# EAGLE design wiegand (EAGLE 6.6.0)
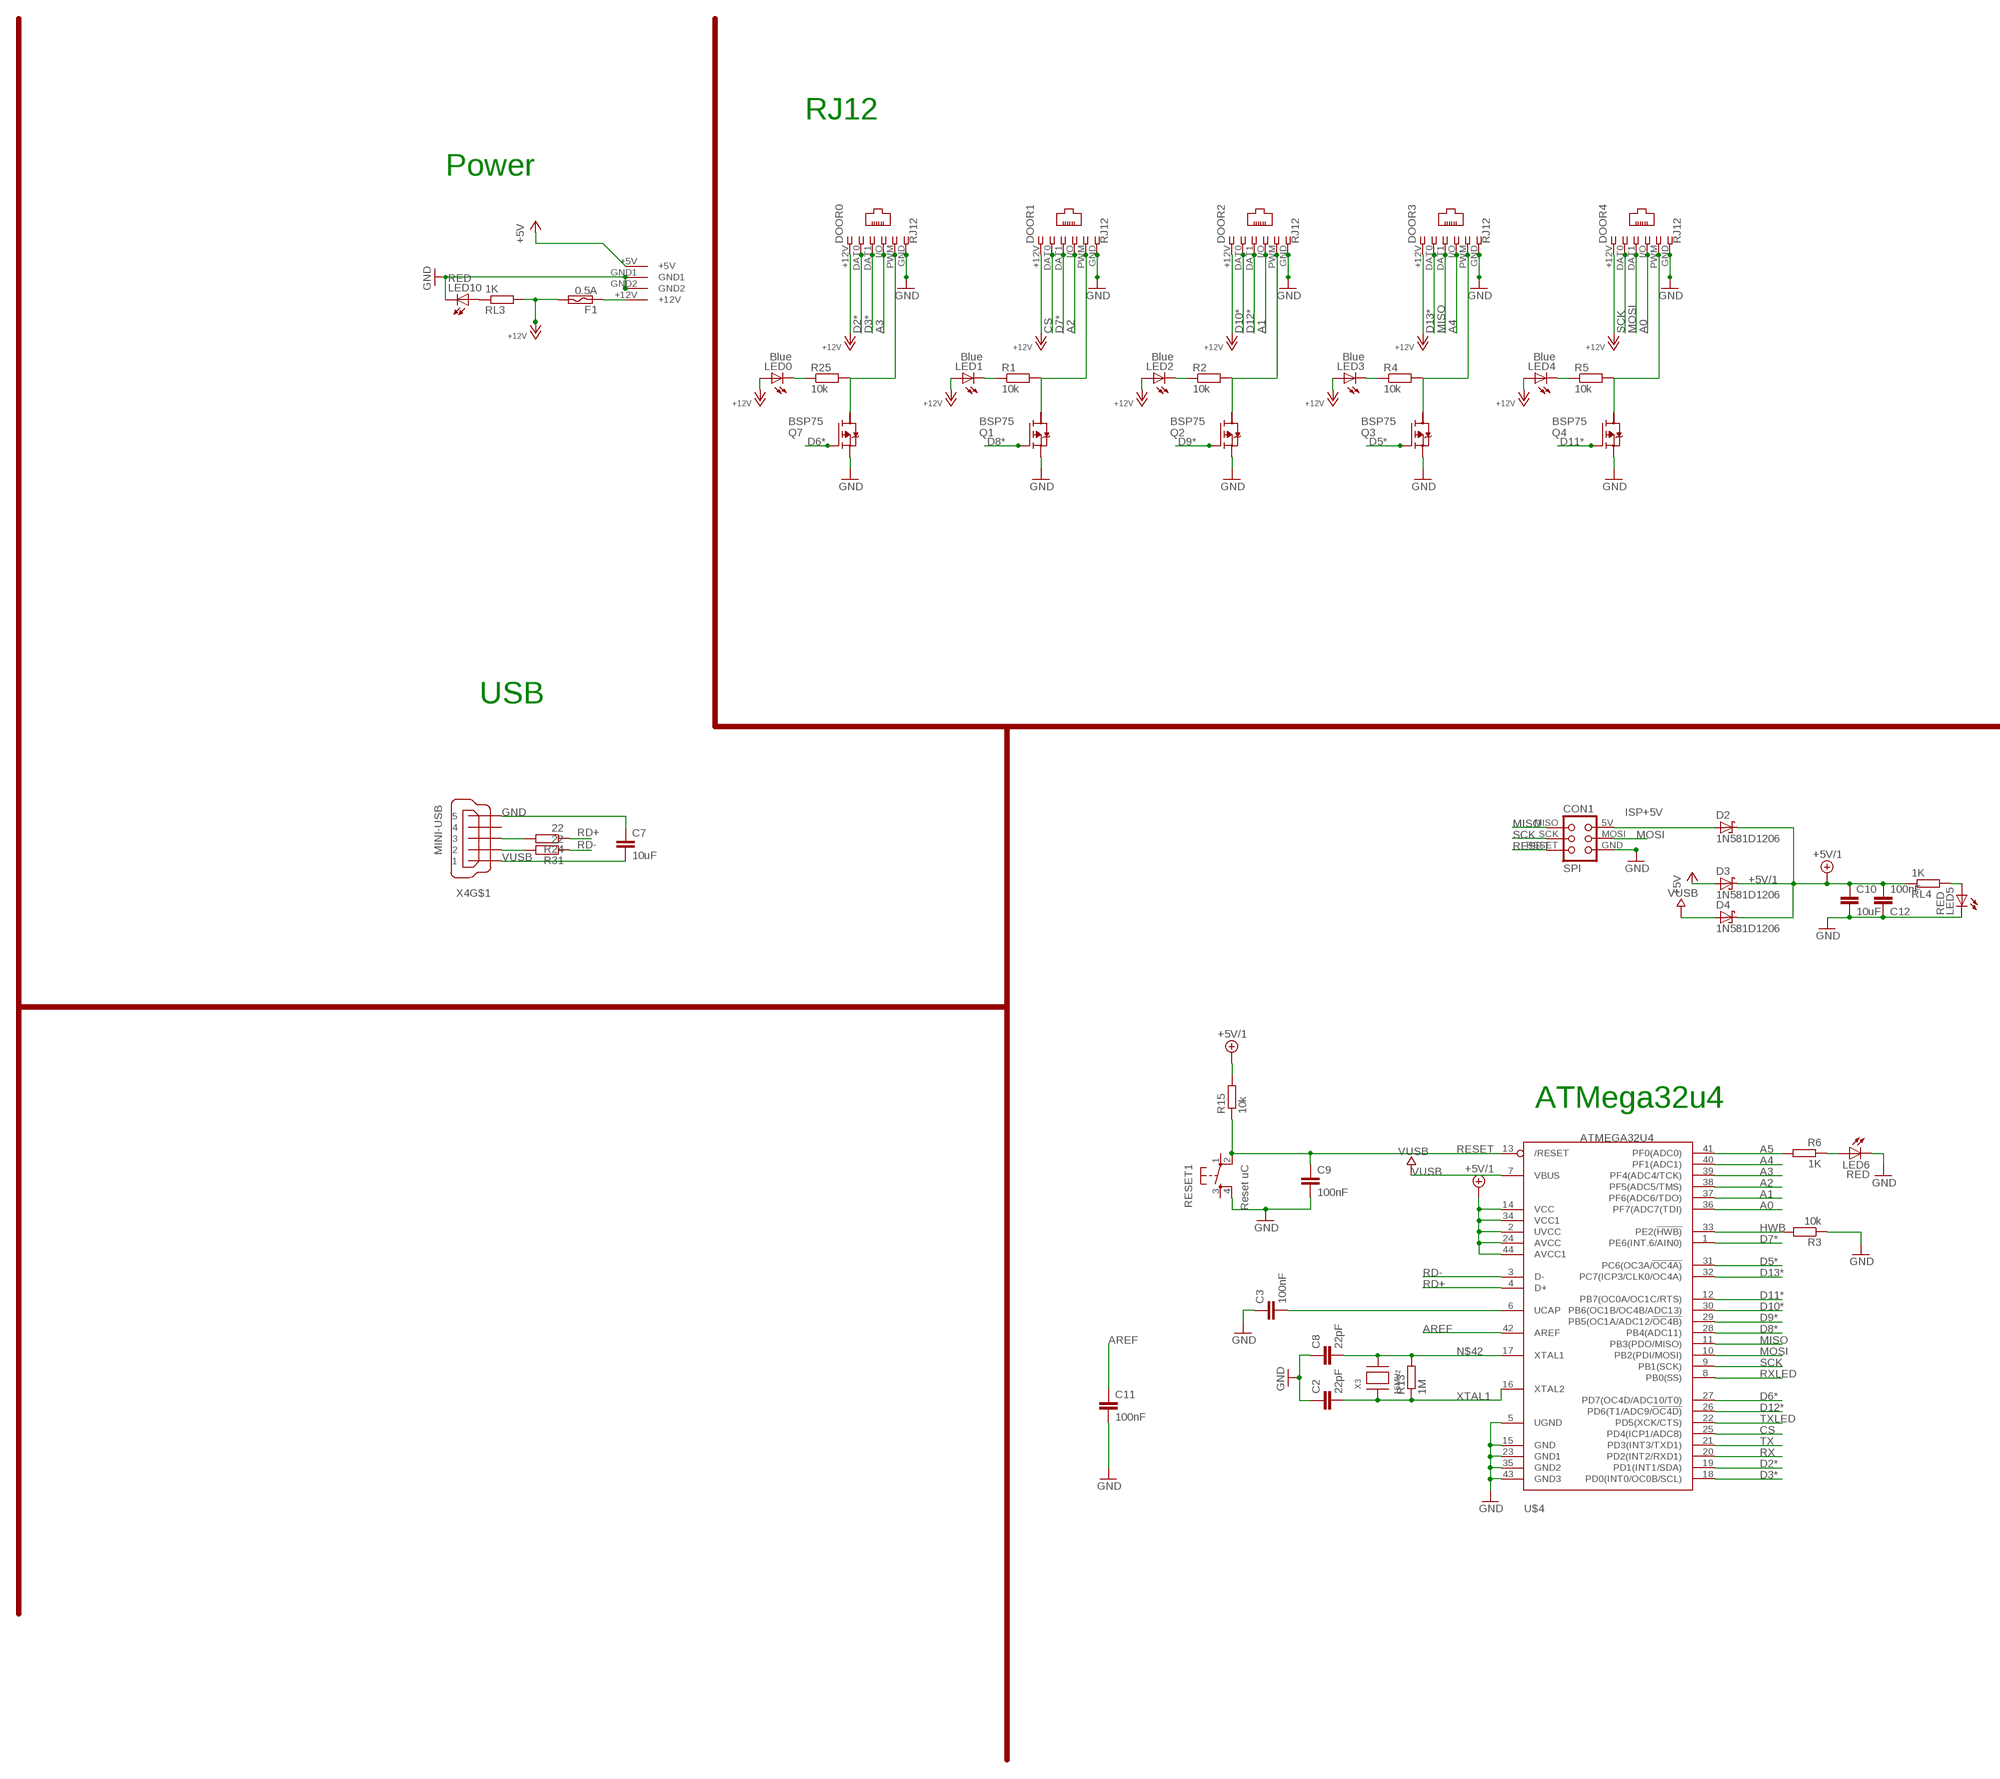
[diagram p0: schematic, sheet 1, part 1 of 2]
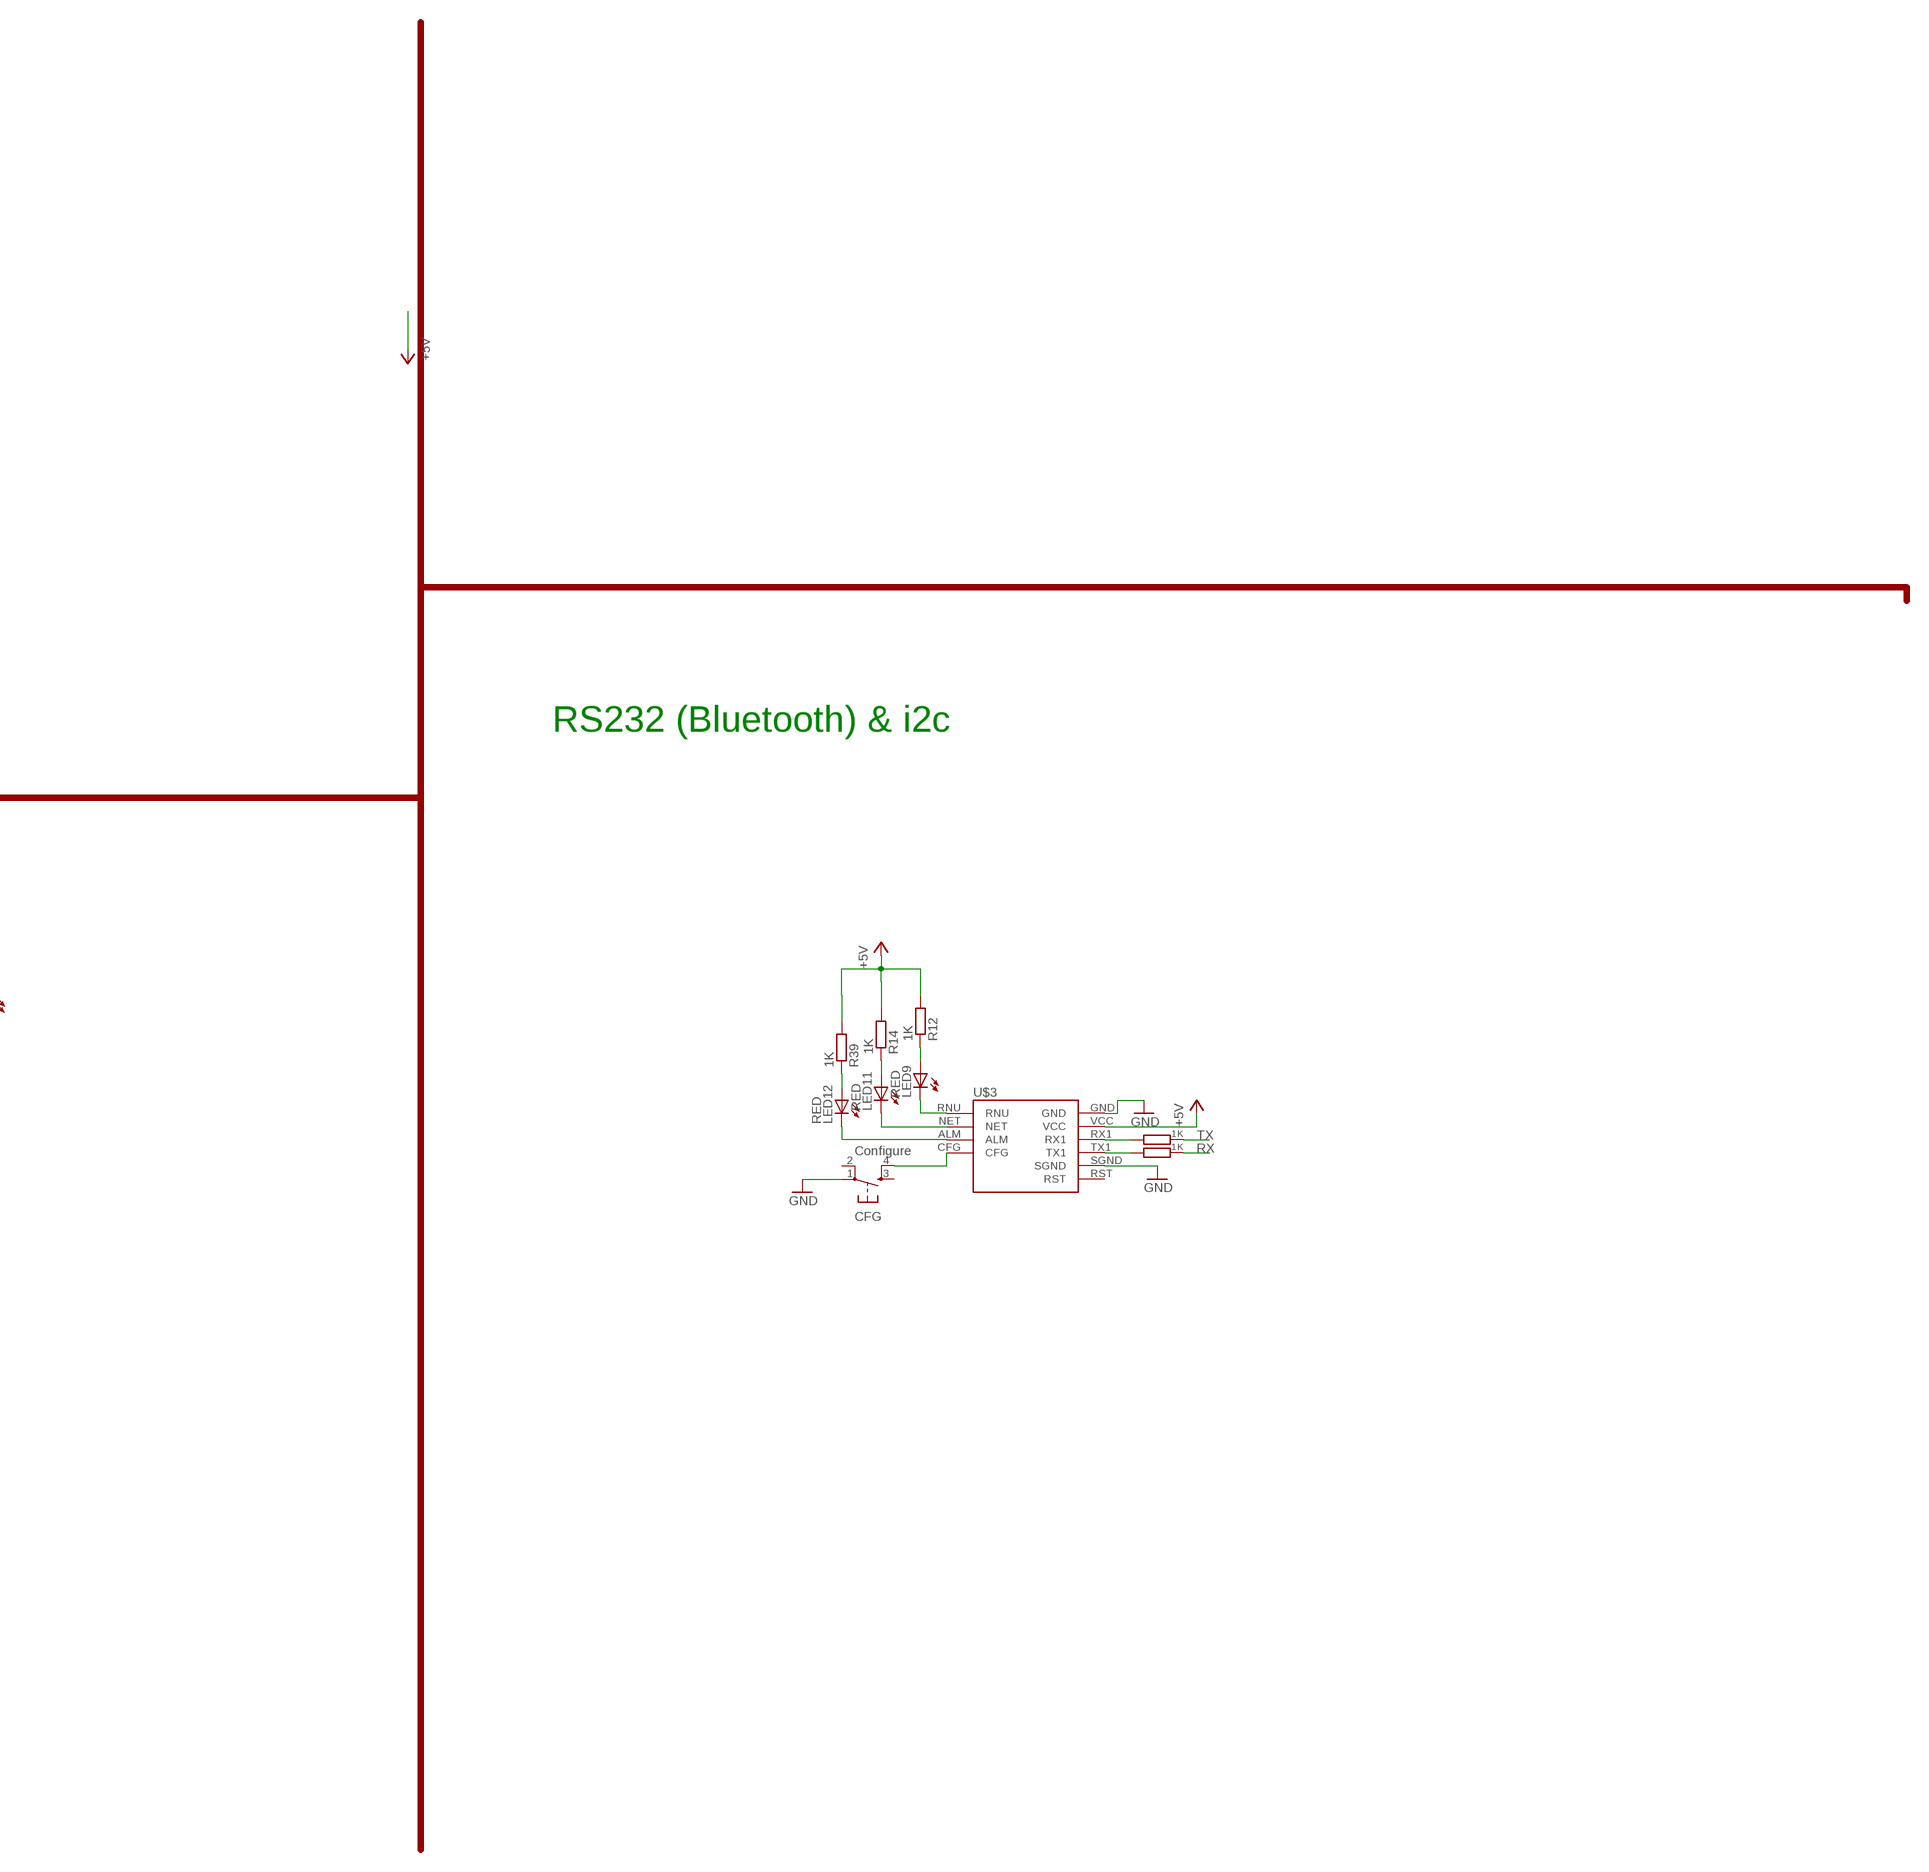
[diagram p1: schematic, sheet 1, part 2 of 2]

## Parts
C2  22pF  C-EUC1206  [C1206]
C3  100nF  C-EUC1206  [C1206]
C7  10uF  C-EUC1206  [C1206]
C8  22pF  C-EUC1206  [C1206]
C9  100nF  C-EUC1206  [C1206]
C10  10uF  C-EUC1206  [C1206]
C11  100nF  C-EUC1206  [C1206]
C12  100nF  C-EUC1206  [C1206]
CFG  Configure  TAC_SWITCHSMD  [TACTILE_SWITCH_SMD]
CON1  SPI  TINYISPTAG  [TC2030-MCP]
D2  1N581D1206  [LED-1206]
D3  1N581D1206  [LED-1206]
D4  1N581D1206  [LED-1206]
DOOR0  RJ12  RJ12STR-WIEGAND  [RJ12-STRAIGHT-WIEGAND]
DOOR1  RJ12  RJ12STR-WIEGAND  [RJ12-STRAIGHT-WIEGAND]
DOOR2  RJ12  RJ12STR-WIEGAND  [RJ12-STRAIGHT-WIEGAND]
DOOR3  RJ12  RJ12STR-WIEGAND  [RJ12-STRAIGHT-WIEGAND]
DOOR4  RJ12  RJ12STR-WIEGAND  [RJ12-STRAIGHT-WIEGAND]
F1  0.5A  POLYSWITCHSMD1812  [C1812]
LED0  Blue  LED1206  [LED-1206]
LED1  Blue  LED1206  [LED-1206]
LED2  Blue  LED1206  [LED-1206]
LED3  Blue  LED1206  [LED-1206]
LED4  Blue  LED1206  [LED-1206]
LED5  RED  LED1206  [LED-1206]
LED6  RED  LED1206  [LED-1206]
LED9  RED  LED1206  [LED-1206]
LED10  RED  LED1206  [LED-1206]
LED11  RED  LED1206  [LED-1206]
LED12  RED  LED1206  [LED-1206]
Q1  BSP75  BSP613P  [PG-SOT-223]
Q2  BSP75  BSP613P  [PG-SOT-223]
Q3  BSP75  BSP613P  [PG-SOT-223]
Q4  BSP75  BSP613P  [PG-SOT-223]
Q7  BSP75  BSP613P  [PG-SOT-223]
R1  10k  R-EU_R0805  [R0805]
R2  10k  R-EU_R0805  [R0805]
R3  10k  R-EU_M0805  [M0805]
R4  10k  R-EU_R0805  [R0805]
R5  10k  R-EU_R0805  [R0805]
R6  1K  R-EU_R0805  [R0805]
R8  1K  R-EU_R0805  [R0805]
R11  1K  R-EU_R0805  [R0805]
R12  1K  R-EU_R0805  [R0805]
R13  1M  R-EU_R1206  [R1206]
R14  1K  R-EU_R0805  [R0805]
R15  10k  R-EU_M0805  [M0805]
R24  22  R-EU_M1206  [M1206]
R25  10k  R-EU_R0805  [R0805]
R31  22  R-EU_M1206  [M1206]
R39  1K  R-EU_R0805  [R0805]
RESET1  Reset uC  TAC_SWITCHSMD  [TACTILE_SWITCH_SMD]
RL3  1K  R-EU_R0805  [R0805]
RL4  1K  R-EU_R0805  [R0805]
U$3  SZ05-ZIGBEE  [SZ05-ZIGBEE]
U$4  ATMEGA32U4  ATMEGA32U4-AU  [TQFP44]
U$6  KPJX-4S-S  [KPJX-4S-S]
X3  16MHz  XTALNX6035  [NX6035]
X4  MINI-USB  MINI-USB-SCHIELD-32005-201  [32005-201]

## Nets
+5V [power]: D3.A R12.2 R14.2 R39.2 U$3.VCC U$6.+5V
+5V1 [power]: R6.2
+5V/1 [fine]: C10.1 C12.2 D2.C D3.C D4.C R15.2 RL4.1 U$4.2(UVCC) U$4.14(VCC) U$4.24(AVCC) U$4.34(VCC1) U$4.44(AVCC1)
+12V [power]: DOOR0.+12V DOOR1.+12V DOOR2.+12V DOOR3.+12V DOOR4.+12V F1.2 LED0.A LED1.A LED2.A LED3.A LED4.A RL3.2
A0: DOOR4.I/O U$4.36(PF7(ADC7(TDI))
A1: DOOR2.I/O U$4.37(PF6(ADC6/TDO))
A2: DOOR1.I/O U$4.38(PF5(ADC5/TMS))
A3: DOOR0.I/O U$4.39(PF4(ADC4/TCK))
A4: DOOR3.I/O U$4.40(PF1(ADC1))
A5: U$4.41(PF0(ADC0))
AREF: C11.1 U$4.42(AREF)
CS: DOOR1.DAT0 U$4.25(PD4(ICP1/ADC8))
D2*: DOOR0.DAT0 U$4.19(PD1(INT1/SDA))
D3*: DOOR0.DAT1 U$4.18(PD0(INT0/OC0B/SCL))
D5*: Q3.1(G) U$4.31(PC6(OC3A/!OC4A))
D6*: Q7.1(G) U$4.27(PD7(OC4D/ADC10/T0))
D7*: DOOR1.DAT1 U$4.1(PE6(INT.6/AIN0))
D8*: Q1.1(G) U$4.28(PB4(ADC11))
D9*: Q2.1(G) U$4.29(PB5(OC1A/ADC12/!OC4B))
D10*: DOOR2.DAT0 U$4.30(PB6(OC1B/OC4B/ADC13))
D11*: Q4.1(G) U$4.12(PB7(OC0A/OC1C/RTS))
D12*: DOOR2.DAT1 U$4.26(PD6(T1/ADC9/!OC4D))
D13*: DOOR3.DAT0 U$4.32(PC7(ICP3/CLK0/OC4A))
D+USB: R24.2 X4.3
D-USB: R31.2 X4.2
GND [power]: C2.1 C3.1 C7.1 C8.1 C9.2 C10.2 C11.2 C12.1 CFG.1 CON1.GND DOOR0.GND DOOR1.GND DOOR2.GND DOOR3.GND DOOR4.GND LED5.C LED6.C LED10.C Q1.3(S) Q2.3(S) Q3.3(S) Q4.3(S) Q7.3(S) R3.1 RESET1.4 U$3.GND U$3.SGND U$4.5(UGND) U$4.15(GND) U$4.23(GND1) U$4.35(GND2) U$4.43(GND3) U$6.GND1 U$6.GND2 X4.5
GND1 [VIN]: LED9.C U$3.RNU
GND2 [VIN]: LED11.C U$3.NET
GND3 [VIN]: LED12.C U$3.ALM
HWB: R3.2 U$4.33(PE2(!HWB))
ISP+5V: CON1.5V(VCC) D2.A
MISO: CON1.MISO DOOR3.DAT1 U$4.11(PB3(PDO/MISO))
MOSI: CON1.MOSI DOOR4.DAT1 U$4.10(PB2(PDI/MOSI))
N$1: LED0.C R25.1
N$2: LED6.A R6.1
N$3 [power]: DOOR1.PWM Q1.2(D) R1.2
N$5: LED1.C R1.1
N$6: LED2.C R2.1
N$7 [power]: DOOR2.PWM Q2.2(D) R2.2
N$8: LED3.C R4.1
N$9: LED4.C R5.1
N$11: R11.2 U$3.RX1
N$12: LED5.A RL4.2
N$16: C3.2 U$4.6(UCAP)
N$22 [power]: DOOR3.PWM Q3.2(D) R4.2
N$23 [power]: DOOR0.PWM Q7.2(D) R25.2
N$24: R8.2 U$3.TX1
N$25: LED9.A R12.1
N$26: LED11.A R14.1
N$27: LED12.A R39.1
N$31 [power]: DOOR4.PWM Q4.2(D) R5.2
N$35: CFG.4 U$3.CFG
N$39: F1.1 U$6.+12V
N$42: C8.2 R13.2 U$4.17(XTAL1) X3.P$2
N$75: LED10.A RL3.1
RD+: R24.1 U$4.4(D+)
RD-: R31.1 U$4.3(D-)
RESET: C9.1 CON1.RESET R15.1 RESET1.2 U$4.13(/RESET)
RX: R8.1 U$4.20(PD2(INT2/RXD1))
RXLED: U$4.8(PB0(SS))
SCK: CON1.SCK DOOR4.DAT0 U$4.9(PB1(SCK))
TX: R11.1 U$4.21(PD3(INT3/TXD1))
TXLED: U$4.22(PD5(XCK/CTS))
VUSB: C7.2 D4.A U$4.7(VBUS) X4.1
XTAL1: C2.2 R13.1 U$4.16(XTAL2) X3.P$1
Unconnected: CFG.2 CFG.3 Q1.4(D) Q2.4(D) Q3.4(D) Q4.4(D) Q7.4(D) RESET1.1 RESET1.3 U$3.RST X4.4 X4.M1(S:S1) X4.M2(S:S2) X4.M3(S:S3) X4.M4(S:S4)

## Notes on the sheet
- RJ12
- Power
- RS232 (Bluetooth) & i2c
- USB
- ATMega32u4

## Library data of the parts
C2 C3 C7-C12 = rcl:C-EU: CAPACITOR, European symbol
CFG RESET1 = lpatiny:TAC_SWITCH: Momentary Switch Button commonly used for reset or general input. Spark Fun Electronics SKU : COM-00097
CON1 = lpatiny:TINYISP: CONNECTOR
D2-D4 = lpatiny:1N581*: 1.0A SCHOTTKY BARRIER RECTIFIER Source: http://www.diodes.com/datasheets/ds23001.pdf
DOOR0 DOOR1-DOOR4 = lpatiny:RJ12: CORCOM Modular RJ Jacks No Shield Source: www.tycoelectronics.com .. ENG_DS_1654001_1099_RJ_L_0507.pdf
F1 = lpatiny:POLYSWITCH: PolySwitch (TM) Resettable Device Source: Data sheet <http://www.farnell.com/datasheets/13482.pdf>
LED0 LED1-LED6 LED9-LED12 = SparkFun:LED: LEDs Standard schematic elements and footprints for 5mm, 3mm, 1206, and 0603 sized LEDs. 5mm - Spark Fun Electronics SKU : COM-00529 (and others)
Q1-Q4 Q7 = infineon:BSP613P: SIPMOS (R) Small-Signal-Transistor P-Channel (2 Drain) Source: http://www.infineon.com/dgdl/BSP613P_Rev2.4.pdf; OC_FARNELL: unknown; OC_NEWARK: unknown
R1 R2 R4-R6 R8 R11-R14 R25 R39 RL3 = rcl:R-EU_: RESISTOR, European symbol
R3 R15 R24 R31 RL4 = resistor:R-EU_: RESISTOR, European symbol
U$3 = lpatiny:SZ05-ZIGBEE
U$4 = adafruit:ATMEGA32U4: http://www.ladyada.net/library/eagle
U$6 = lpatiny:KPJX-4S-S
X3 = lpatiny:XTAL: Low cost SMT crystals, no capacitors included http://www.ladyada.net/library/eagle
X4 = con-cypressindustries:MINI-USB-SCHIELD-: MINI USB-B Conector Source: www.cypressindustries.com; OC_FARNELL: unknown; OC_NEWARK: unknown

## Net classes
0 default: width 0.457 mm
1 power: width 0.61 mm
2 VIN: width 0.457 mm
3 fine: width 0.457 mm
4 aref: width 0.457 mm

## Board
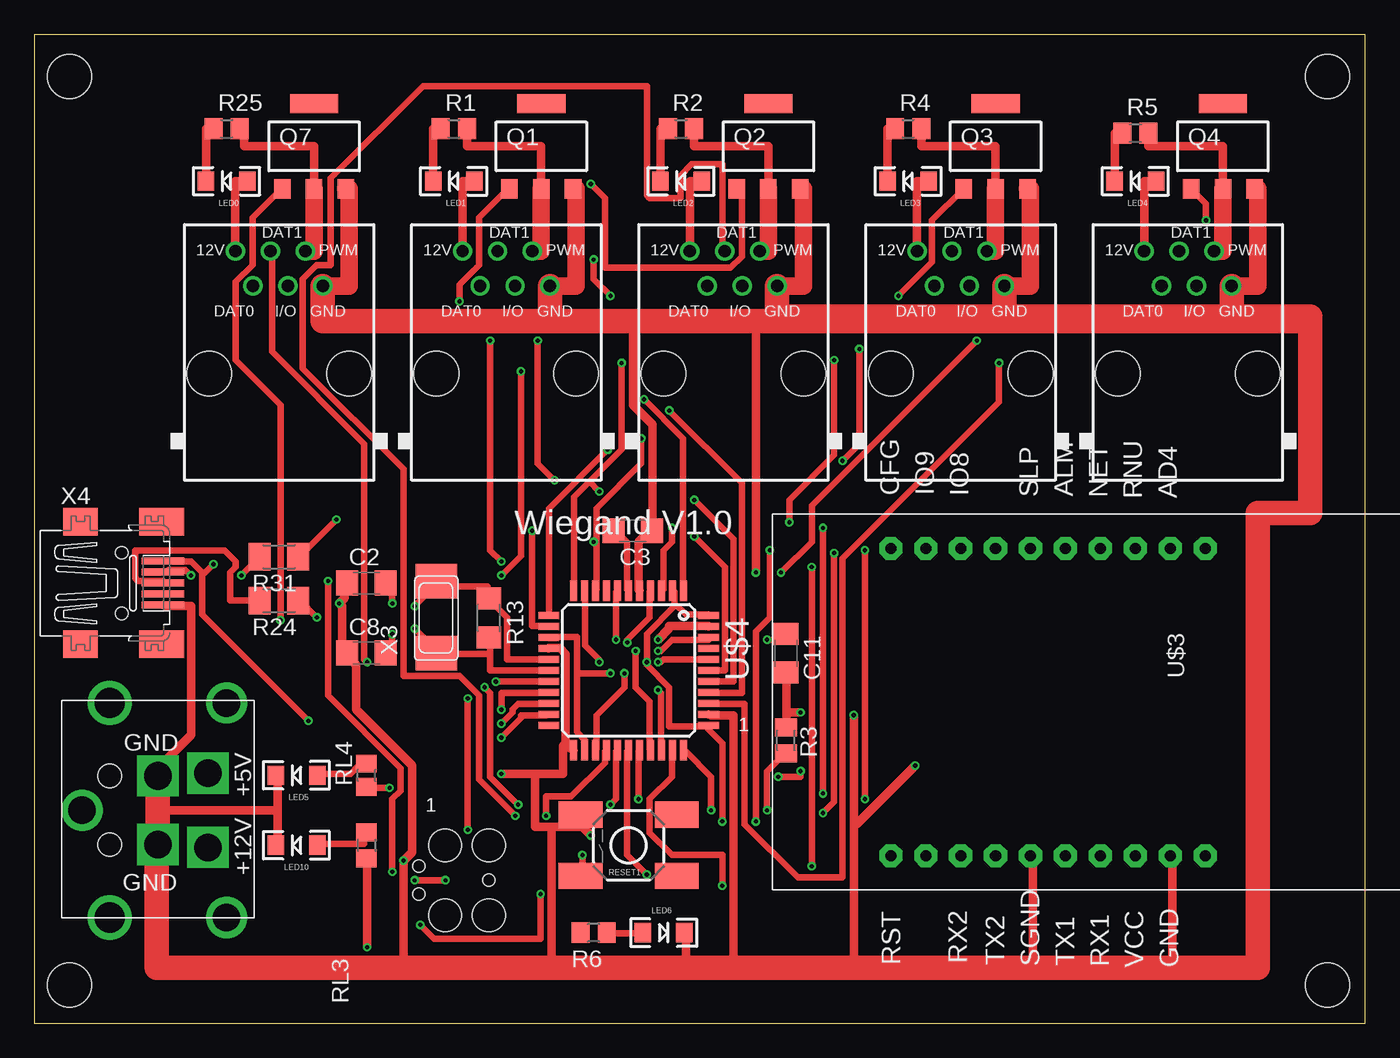
[diagram p2: board, top side]
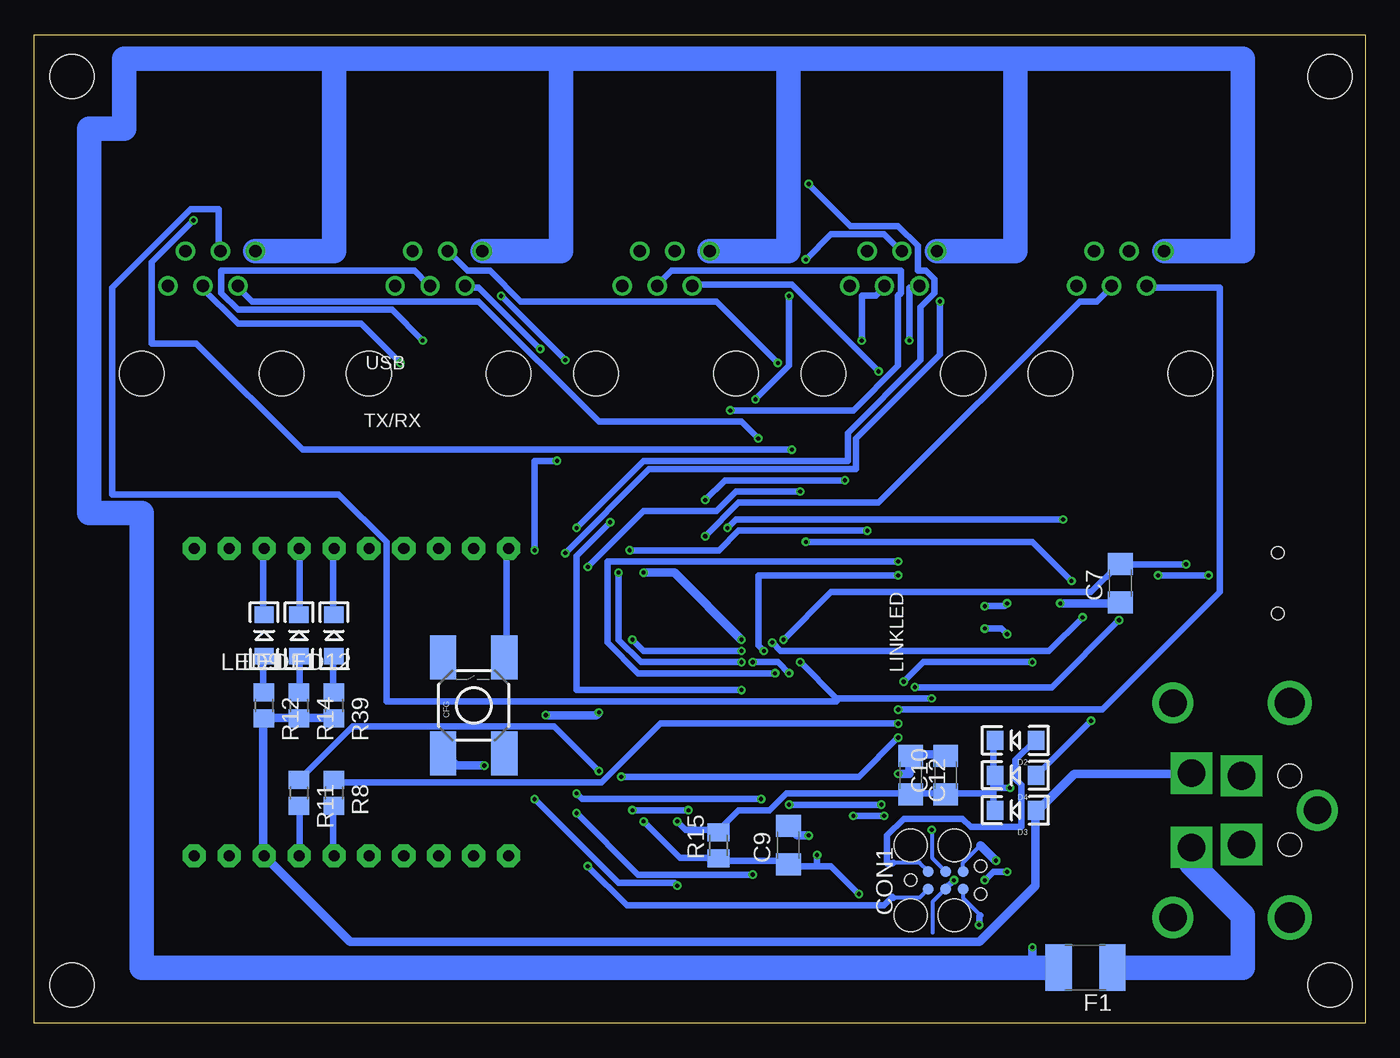
[diagram p3: board, bottom side, seen from below]

Size 96.7 x 71.87 mm. Coordinates in mm from the lower left corner, seen from the top.
Outline: 0,0 96.7,0 96.7,71.87 0,71.87 0,0
Copper layers (1*16): Top 0.035mm / dielectric 1.5mm / Bottom 0.035mm
Design rules "Fusion_eagle_rule_v1.1": minimum track width 6mil, minimum drill 12mil, track to track 6mil, track to pad 6mil, pad to pad 6mil, via to via 6mil, smd to smd 0mil, copper to edge 10mil, drill to drill 10mil, minimum pad ring 10mil, minimum via ring 6mil, stop-mask expansion 2mil, vias tented up to drill 100mil, thermal gap 10mil
Holes 3.2 mm at 2.54,2.79 2.54,68.83 93.98,68.83 93.98,2.79
bKeepout: area -1.3,54.9 to 114.3,82.8; area -7.6,52.3 to 108,80.3
vRestrict: area 47,23.1 to 62.2,26.9; area 34.3,16.8 to 52.1,23.1; area 34.3,28.2 to 52.1,34.5; area 45.7,16.8 to 52.1,34.5; area 34.3,16.8 to 40.6,34.5

### Footprints (pad centres in the part's own frame; a part is rotated, then mirrored left to right if it is on the bottom)
C1206 = smd 1.6 x 1.8: 1 -1.4,0; 2 1.4,0
TACTILE_SWITCH_SMD = smd 3.175 x 1.905: 1 -3.493,2.223; 2 3.493,2.223; 3 -3.493,-2.223; 4 3.493,-2.223
TC2030-MCP = smd 0.787 x 0.787: 5V 1.27,0.635; GND 3.81,0.635; MISO 1.27,-0.635; MOSI 2.54,0.635; RESET 3.81,-0.635; SCK 2.54,-0.635 | hole 0.889: 0,0; 5.08,-1.016; 5.08,1.016 | hole 2.375: 0,2.54; 0,-2.54; 3.175,-2.54; 3.175,2.54
LED-1206 = smd 1.2 x 1.4: A -1.5,0; C 1.5,0
RJ12-STRAIGHT-WIEGAND = drill 0.9 pad 1.4: +12V -3.175,7.62; DAT0 -1.905,5.08; DAT1 -0.635,7.62; GND 3.175,5.08; I/O 0.635,5.08; PWM 1.905,7.62 | hole 3.251: -5.08,-1.27; 5.08,-1.27
C1812 = smd 1.9 x 3.4: 1 -1.95,0; 2 1.95,0
PG-SOT-223 = smd 1.2 x 1.4: 1 -2.311,-3.099; 2 0,-3.099; 3 2.311,-3.099 | smd 3.5 x 1.4: 4 0,3.099
R0805 = smd 1.3 x 1.5: 1 -0.95,0; 2 0.95,0
M0805 = smd 1.3 x 1.6: 1 -0.95,0; 2 0.95,0
R1206 = smd 1.6 x 1.803: 1 -1.422,0; 2 1.422,0
M1206 = smd 1.6 x 2: 1 -1.4,0; 2 1.4,0
R0805' = smd 1.3 x 1.5: 1 -0.85,0; 2 0.85,0
SZ05-ZIGBEE = drill 0.8 pad 1.676 octagon: 6 -11.415,13.971; 7 -11.415,11.431; 11 -11.415,1.271; 12 -11.415,-1.269; 13 -11.415,-3.809; 14 -11.415,-6.349; 17 10.925,-6.349; 18 10.925,-3.809; 19 10.925,-1.269; 25 10.925,13.971; ALM -11.415,3.811; CFG -11.415,-8.889; GND 10.925,11.431; NET -11.415,6.351; RNU -11.415,8.891; RST 10.925,-8.889; RX1 10.925,6.351; SGND 10.925,1.271; TX1 10.925,3.811; VCC 10.925,8.891
TQFP44 = smd 1.5 x 0.5: 1 -5.8,4; 2 -5.8,3.2; 3 -5.8,2.4; 4 -5.8,1.6; 5 -5.8,0.8; 6 -5.8,0; 7 -5.8,-0.8; 8 -5.8,-1.6; 9 -5.8,-2.4; 10 -5.8,-3.2; 11 -5.8,-4; 23 5.8,-4; 24 5.8,-3.2; 25 5.8,-2.4; 26 5.8,-1.6; 27 5.8,-0.8; 28 5.8,0; 29 5.8,0.8; 30 5.8,1.6; 31 5.8,2.4; 32 5.8,3.2; 33 5.8,4 | smd 0.5 x 1.5: 12 -4,-5.8; 13 -3.2,-5.8; 14 -2.4,-5.8; 15 -1.6,-5.8; 16 -0.8,-5.8; 17 0,-5.8; 18 0.8,-5.8; 19 1.6,-5.8; 20 2.4,-5.8; 21 3.2,-5.8; 22 4,-5.8; 34 4,5.8; 35 3.2,5.8; 36 2.4,5.8; 37 1.6,5.8; 38 0.8,5.8; 39 0,5.8; 40 -0.8,5.8; 41 -1.6,5.8; 42 -2.4,5.8; 43 -3.2,5.8; 44 -4,5.8
KPJX-4S-S = drill 2 square: +5V 2.7,1.35; +12V -2.7,1.35; GND1 -2.5,5; GND2 2.5,5 | drill 2: P$1 -7.8,0; P$2 7.8,0; P$11 0,10.5 | drill 2.2: P$3 -7.8,8.5; P$4 7.8,8.5 | hole 1.7: -2.5,8.5; 2.5,8.5
NX6035 = smd 2.5 x 3: P$1 2.665,0; P$2 -2.565,0
32005-201 = smd 3.1 x 0.5: 1 3,1.6; 2 3,0.8; 3 3,0; 4 3,-0.8; 5 3,-1.6 | smd 2.5 x 2: M1 -3,-4.45; M2 -3,4.45 | smd 3.3 x 2: M3 2.9,4.45; M4 2.9,-4.45 | hole 0.9: 0,2.2; 0,-2.2

### Placement (x,y rotation side)
C2  24.13,32 0 top
C3  43.5,35.81 180 top
C7  17.78,32 90 bottom
C8  24.13,26.92 0 top
C9  41.91,12.95 90 bottom
C10  30.48,18.03 90 bottom
C11  54.61,26.92 270 top
C12  33.02,18.03 270 bottom
CFG  64.77,23.11 90 bottom
CON1  33.02,10.41 0 bottom
D2  25.4,20.57 180 bottom
D3  25.4,15.49 180 bottom
D4  25.4,18.03 180 bottom
DOOR0  17.78,48.51 0 top
DOOR1  34.29,48.51 0 top
DOOR2  50.8,48.51 0 top
DOOR3  67.31,48.51 0 top
DOOR4  83.82,48.51 0 top
F1  20.32,4.06 180 bottom
LED0  13.97,61.21 180 top
LED1  30.48,61.21 180 top
LED2  46.99,61.21 180 top
LED3  63.5,61.21 180 top
LED4  80.01,61.21 180 top
LED5  19.05,18.03 180 top
LED6  45.72,6.6 0 top
LED9  80.01,28.19 90 bottom
LED10  19.05,12.95 180 top
LED11  77.47,28.19 90 bottom
LED12  74.93,28.19 90 bottom
Q1  36.83,63.75 0 top
Q2  53.34,63.75 0 top
Q3  69.85,63.75 0 top
Q4  86.36,63.75 0 top
Q7  20.32,63.75 0 top
R1  30.48,65.02 0 top
R2  46.99,65.02 0 top
R3  54.61,20.57 270 top
R4  63.5,65.02 0 top
R5  80.01,64.71 0 top
R6  40.64,6.6 180 top
R8  74.93,16.76 270 bottom
R11  77.47,16.76 270 bottom
R12  80.01,23.11 270 bottom
R13  33.02,29.46 270 top
R14  77.47,23.11 270 bottom
R15  46.99,12.95 90 bottom
R24  17.78,30.73 180 top
R25  13.97,65.02 0 top
R31  17.78,33.91 180 top
R39  74.93,23.11 270 bottom
RESET1  43.18,12.95 180 top
RL3  24.13,12.95 270 top
RL4  1K  [R0805']  24.13,18.03 90 top
U$3  71.12,23.11 270 top
U$4  43.18,25.65 270 top
U$6  13.97,15.49 90 top
X3  29.21,29.46 90 top
X4  6.35,32 0 top

### Tracks (layer width: path | path; a pad name or v marks a point on that pad's centre or on a via)
+5V
  Bottom 0.61: R39.2 74.98,22.2 77.42,22.2 R14.2 77.62,22.2 79.86,22.2 R12.2 80.06,22 80.06,12.24 U$3.VCC 79.86,12.04 73.76,5.94 28.04,5.94 23.98,10.01 23.98,15.29 D3.A 23.77,15.49 21.13,18.14 12.8,18.14 U$6.+5V
+5V/1  (via drill 0.3)
  Top 0.457: 39.42,25.45 39.42,21.18 40.03,20.57 40.03,19.96 U$4.24 | 39.42,25.45 39.42,28.09 37.39,28.09 U$4.14 | 46.53,30.53 46.53,31.34 U$4.2 | 46.53,30.53 47.35,29.72 48.97,29.72 U$4.44 | 48.97,21.59 46.13,21.59 46.13,24.44 44.5,26.06 v44.5,26.26 44.5,28.3 46.53,30.33 46.53,30.53 | 48.97,21.59 U$4.34 | v41.86,25.45 39.42,25.45 | v25.81,17.12 24.18,17.12 RL4.1 | v49.99,14.68 49.99,20.37 48.97,21.39 48.97,21.59
  Bottom 0.457: v41.86,25.45 42.67,26.26 v44.5,26.26 | 27.03,17.12 27.03,17.93 D4.C 27.03,18.14 27.03,20.57 D2.C | 27.03,17.12 27.03,16.71 | 27.03,16.71 27.03,15.49 D3.C | 27.03,17.12 v25.81,17.12 | 27.03,16.71 30.28,16.71 C10.1 30.48,16.71 32.92,16.71 C12.2 33.12,16.71 42.06,16.71 43.28,15.49 45.52,15.49 46.94,14.07 R15.2 47.14,14.07 49.38,14.07 v49.99,14.68
+12V  (via drill 0.3)
  Top 0.61: LED0.A 14.61,61.21 DOOR0.+12V | LED1.A 31.11,61.21 DOOR1.+12V | LED2.A 47.62,61.21 DOOR2.+12V | LED3.A 64.14,61.21 DOOR3.+12V | LED4.A 80.64,61.21 DOOR4.+12V | v24.18,5.54 24.18,11.84 RL3.2
  Bottom 0.61: v24.18,5.54 24.18,4.06
  Bottom 1.778: F1.2 24.18,4.06 88.9,4.06 88.9,37.08 92.71,37.08 92.71,65.02 90.17,65.02 90.17,70.1 74.93,70.1 | 74.93,70.1 58.42,70.1 | 58.42,70.1 41.91,70.1 | 41.91,70.1 25.4,70.1 | 25.4,70.1 8.89,70.1 8.89,56.13 DOOR0.+12V | DOOR1.+12V 25.4,56.13 25.4,70.1 | DOOR2.+12V 41.91,56.13 41.91,70.1 | DOOR3.+12V 58.42,56.13 58.42,70.1 | DOOR4.+12V 74.93,56.13 74.93,70.1
A0  (via drill 0.3)
  Top 0.457: v70.1,48.01 70.1,45.16 58.73,33.78 58.73,10.62 55.47,10.62 51.61,14.48 51.61,23.22 49.17,23.22 U$4.36
  Bottom 0.457: v70.1,48.01 72.95,50.85 81.89,50.85 84.53,53.49 DOOR4.I/O
A1  (via drill 0.3)
  Top 0.457: v46.13,44.55 51.41,39.27 51.41,24.03 49.17,24.03 U$4.37
  Bottom 0.457: v46.13,44.55 37.19,44.55 33.93,47.8 33.93,52.88 33.73,53.09 33.73,54.71 50.39,54.71 51.41,53.7 DOOR2.I/O
A2  (via drill 0.3)
  Top 0.457: v47.95,38.05 50.8,35.2 50.8,24.84 49.17,24.84 U$4.38 | v37.8,39.47 36.58,40.69 v36.58,49.63
  Bottom 0.457: v47.95,38.05 46.53,39.47 v37.8,39.47 | v36.58,49.63 36.58,52.88 35.56,52.88 34.95,53.49 DOOR1.I/O
A3  (via drill 0.3)
  Top 0.457: U$4.39 50.19,25.65 50.19,33.17 v47.95,35.41
  Bottom 0.457: v47.95,35.41 45.52,37.85 35.36,37.85 20.73,52.48 19.51,52.48 18.49,53.49 DOOR0.I/O
A4  (via drill 0.3)
  Top 0.457: v45.31,26.26 45.52,26.26 45.72,26.47 48.97,26.47 U$4.40 | v54.25,32.77 56.49,35 56.49,37.64 v68.48,49.63
  Bottom 0.457: v45.31,26.26 52.63,26.26 54.25,27.89 v54.25,32.77 | v68.48,49.63 70.71,51.87 81.89,51.87 83.11,53.09 83.11,54.71 69.09,54.71 68.07,53.7 DOOR3.I/O
AREF  (via drill 0.3)
  Top 0.457: v45.31,27.08 45.52,27.08 46.33,27.89 48.97,27.89 U$4.42 | v53.24,27.89 54.46,27.89 54.46,28.3 C11.1
  Bottom 0.457: v45.31,27.08 52.43,27.08 v53.24,27.89
CS  (via drill 0.3)
  Top 0.457: v42.88,25.45 42.88,24.44 40.84,22.4 40.84,19.96 U$4.25 | v33.93,33.58 33.12,34.39 v33.12,49.63
  Bottom 0.457: v42.88,25.45 52.83,25.45 55.07,27.69 55.07,33.58 v33.93,33.58 | v33.12,49.63 33.12,53.49 32.51,53.49 DOOR1.DAT0
D2*  (via drill 0.3)
  Top 0.457: v33.93,22.81 33.93,24.03 37.19,24.03 U$4.19
  Bottom 0.457: v33.93,22.81 19.1,22.81 10.57,31.34 10.57,53.49 15.85,53.49 DOOR0.DAT0
D3*  (via drill 0.3)
  Top 0.457: v33.53,24.84 37.19,24.84 U$4.18 | v24.18,26.26 23.98,26.47 23.98,42.11 17.27,48.82 17.27,56.13 DOOR0.DAT1
  Bottom 0.457: v33.53,24.84 32.11,26.26 v24.18,26.26
D5*  (via drill 0.3)
  Top 0.457: v62.79,52.88 65.23,55.32 65.23,58.37 67.46,60.6 Q3.1 | v58.12,48.21 58.12,41.3 54.86,38.05 v54.86,36.42 | v45.31,24.23 45.52,24.03 45.52,19.96 U$4.31
  Bottom 0.457: v58.12,48.21 v62.79,52.88 | v54.86,36.42 57.3,33.98 57.3,24.23 v45.31,24.23
D6*  (via drill 0.3)
  Top 0.457: v17.88,29.31 17.88,44.96 14.63,48.21 14.63,53.9 15.85,55.12 15.85,58.57 17.88,60.6 Q7.1 | v32.72,24.44 33.12,24.03 33.12,17.93 v35.15,15.9 | v41.86,15.9 42.27,16.31 42.27,19.76 U$4.27
  Bottom 0.457: v17.88,29.31 22.76,24.44 v32.72,24.44 | v41.86,15.9 v35.15,15.9
D7*  (via drill 0.3)
  Top 0.457: v44.3,45.36 47.14,42.52 47.14,31.55 U$4.1 | v41.86,52.88 40.64,54.1 v40.64,55.52
  Bottom 0.457: v44.3,45.36 41.86,47.8 v41.86,52.88 | v40.64,55.52 38.81,57.35 34.95,57.35 33.73,56.13 DOOR1.DAT1
D8*  (via drill 0.3)
  Top 0.457: v30.89,52.48 30.89,53.7 32.31,55.12 32.31,58.57 34.34,60.6 Q1.1 | v58.12,34.19 58.12,16.1 v57.3,15.29 | v44.5,10.82 43.08,12.24 43.08,19.76 U$4.28
  Bottom 0.457: v30.89,52.48 30.89,48.62 36.98,42.52 36.98,40.28 52.02,40.28 v58.12,34.19 | v57.3,15.29 52.83,10.82 v44.5,10.82
D9*  (via drill 0.3)
  Top 0.457: v40.44,61.01 41.45,59.99 41.45,54.91 50.6,54.91 51.41,55.73 51.41,60.4 51.21,60.6 Q2.1 | v57.3,16.71 v57.3,36.02 | v43.89,16.31 43.89,19.76 U$4.29
  Bottom 0.457: v40.44,61.01 37.39,57.96 33.93,57.96 32.51,56.54 32.51,54.71 31.9,54.71 31.29,54.1 31.29,53.09 32.31,52.07 32.31,48.21 37.59,42.93 37.59,40.89 52.43,40.89 v57.3,36.02 | v57.3,16.71 56.9,16.31 v43.89,16.31
D10*  (via drill 0.3)
  Top 0.457: v43.69,27.08 43.69,24.44 44.7,23.42 44.7,19.96 U$4.30 | v33.93,32.56 35.36,33.98 v35.36,47.4
  Bottom 0.457: v43.69,27.08 44.09,27.48 44.09,32.56 v33.93,32.56 | v35.36,47.4 41.66,53.7 48.77,53.7 DOOR2.DAT0
D11*  (via drill 0.3)
  Top 0.457: v85.14,58.37 85.14,59.59 84.12,60.6 Q4.1 | v41.66,41.71 37.39,37.44 37.39,29.72 U$4.12
  Bottom 0.457: v85.14,58.37 88.19,55.32 88.19,49.43 84.94,49.43 77.22,41.71 v41.66,41.71
D12*  (via drill 0.3)
  Top 0.457: v37.19,15.09 37.19,16.51 39.01,16.51 41.45,18.95 41.45,19.76 U$4.26 | v34.95,15.09 32.31,17.73 32.31,23.83 30.89,25.25 26.82,25.25 26.82,40.28 19.51,47.6 19.51,54.1 20.52,55.12 21.54,55.12 21.54,61.42 28.25,68.12 44.5,68.12 44.5,60.2 44.7,59.99 46.94,59.99 46.94,61.62 47.75,62.43 49.99,62.43 49.99,56.13 DOOR2.DAT1
  Bottom 0.457: v34.95,15.09 v37.19,15.09
D13*  (via drill 0.3)
  Top 0.457: v49.99,10.01 49.99,12.24 46.33,12.24 44.7,13.87 44.7,16.31 46.33,17.93 46.33,19.76 U$4.32 | v60.35,34.39 v60.35,16.31 | v58.73,40.89 59.94,42.11 v59.94,49.02
  Bottom 0.457: v49.99,10.01 50.19,10.21 54.25,10.21 v60.35,16.31 | v60.35,34.39 60.35,40.89 v58.73,40.89 | v59.94,49.02 64.41,53.49 65.23,53.49 DOOR3.DAT0
D+USB
  Top 0.457: R24.2 14.22,30.73 14.22,32.77 14.63,33.17 14.63,33.58 13.82,34.39 7.32,34.39 7.32,32.36 7.52,32.16 9.35,32.16 X4.3
D-USB  (via drill 0.3)
  Top 0.457: v15.04,32.56 16.26,33.78 R31.2 | v11.38,32.56 10.97,32.97 9.75,32.97 9.55,32.77 X4.2
  Bottom 0.457: v11.38,32.56 v15.04,32.56
GND  (via drill 0.3)
  Top 0.457: 9.2,18.85 U$6.GND2
  Top 0.61: v40.44,13.66 39.83,14.28 39.83,15.09 RESET1.4 39.62,14.28 37.59,14.28 | 38.61,20.37 39.01,19.96 U$4.23 | 38.61,20.37 38.61,26.87 38.2,27.28 37.39,27.28 U$4.15 | 36.37,18.14 38.41,18.14 38.41,20.17 38.61,20.37 | 36.37,18.14 v33.93,18.14 | 37.59,14.28 36.37,14.28 36.37,18.14 | C2.1 22.55,31.95 22.55,30.94 v22.15,30.53 22.35,30.33 22.35,27.28 22.55,27.08 C8.1 22.76,26.67 23.37,26.06 23.37,22.81 27.43,18.75 27.43,12.45 v26.82,11.84 26.82,4.06 | U$4.5 43.89,31.55 43.89,35 44.7,35.81 C3.1 44.91,36.02 44.91,43.54 43.48,44.96 43.48,51.05 | 17.68,15.49 17.68,17.93 LED5.C | 17.68,15.49 17.68,13.06 LED10.C | 54.66,22.61 54.66,25.45 C11.2 | 54.66,22.61 54.66,21.59 R3.1 | 47.35,4.06 47.35,6.55 LED6.C | 50.8,4.06 50.8,22.4 49.17,22.4 U$4.35 | v45.31,27.89 46.13,28.7 46.13,28.91 48.97,28.91 U$4.43 | 52.43,51.05 v52.43,32.77 | v55.68,22.61 54.66,22.61 | 59.54,4.06 59.54,14.48 | 59.54,14.48 v59.54,22.4 | 8.97,15.49 17.68,15.49 | X4.5 9.55,30.33 11.38,30.33 11.38,20.98 9.35,18.95 U$6.GND2 | v64.01,18.75 59.74,14.48 59.54,14.48 | 72.54,4.06 72.54,12.04 U$3.SGND | 82.7,4.06 82.7,12.04 U$3.GND | 37.59,4.06 37.59,14.28
  Top 1.27: Q7.3 22.86,60.66 22.86,53.59 DOOR0.GND | Q1.3 39.37,60.66 39.37,53.59 DOOR1.GND | Q2.3 55.88,60.66 55.88,53.59 DOOR2.GND | Q3.3 72.39,60.66 72.39,53.59 DOOR3.GND | Q4.3 88.9,60.66 88.9,53.59 DOOR4.GND
  Top 1.778: 87,51.05 70.48,51.05 | 70.48,51.05 53.98,51.05 | 53.98,51.05 52.43,51.05 43.48,51.05 37.47,51.05 | 37.47,51.05 20.95,51.05 DOOR0.GND | U$6.GND2 8.97,15.49 U$6.GND1 8.89,12.91 8.89,4.06 26.82,4.06 37.59,4.06 47.35,4.06 50.8,4.06 59.54,4.06 72.54,4.06 82.7,4.06 88.9,4.06 88.9,37.08 92.71,37.08 92.71,51.05 | DOOR1.GND 37.47,51.05 | 53.98,51.37 53.98,51.05 | DOOR3.GND 70.48,51.05 | DOOR4.GND 87,51.05 | 92.71,51.05 87,51.05 | DOOR2.GND 53.98,51.37 | 53.98,51.37 92.71,51.37 92.71,51.05
  Bottom 0.305: CON1.GND 29.21,11.68 27.94,12.95
  Bottom 0.61: v40.44,13.66 41.25,13.66 41.86,14.28 C9.2 | C10.2 30.48,19.56 32.92,19.56 C12.1 33.12,19.15 33.12,18.14 v33.93,18.14 | v22.15,30.53 17.88,30.53 C7.1 | v45.31,27.89 50.19,32.77 v52.43,32.77 | v26.82,11.84 27.94,12.95 | v55.68,22.61 55.88,22.4 v59.54,22.4 | v64.01,18.75 66.04,18.75 66.85,19.56 CFG.1
GND1
  Bottom 0.457: LED9.C 80.06,29.72 80.06,34.39 U$3.RNU
GND2
  Bottom 0.457: LED11.C 77.42,29.72 77.42,34.39 U$3.NET
GND3
  Bottom 0.457: LED12.C 74.98,29.72 74.98,34.39 U$3.ALM
HWB  (via drill 0.3)
  Top 0.457: v49.17,15.49 49.17,17.93 47.35,19.76 U$4.33 | v53.24,15.49 53.24,18.34 54.46,19.56 R3.2
  Bottom 0.457: v53.24,15.49 v49.17,15.49
ISP+5V
  Bottom 0.305: CON1.5V 32.38,11.68 34.29,11.68
  Bottom 0.457: D2.A 23.98,20.57 25.4,19.15 25.4,17.73 24.99,17.32 24.99,14.28 28.65,14.28 29.26,14.88 33.53,14.88 34.75,13.66 34.75,11.63 34.34,11.63 34.29,11.68
MISO  (via drill 0.3)
  Top 0.457: 40.34,39.37 42.67,41.71 v42.67,48.01 | 40.34,39.37 39.22,38.25 39.22,31.55 U$4.11 | v56.49,33.17 v56.49,11.43 | 40.34,39.37 v41.05,38.66
  Bottom 0.305: CON1.MISO 32.38,9.14 34.29,9.14
  Bottom 0.457: v42.67,48.01 47.14,52.48 61.37,52.48 63.6,54.71 65.23,54.71 66.65,56.13 DOOR3.DAT1 | v56.49,11.43 53.65,8.58 34.95,8.58 34.34,9.2 34.29,9.14 | v56.49,33.17 52.43,37.24 47.14,37.24 45.72,38.66 v41.05,38.66
MOSI  (via drill 0.3)
  Top 0.457: v41.05,26.26 41.05,26.47 40.03,27.48 40.03,31.34 U$4.10 | v31.5,14.07 v31.5,23.62
  Bottom 0.305: CON1.MOSI 31.43,12 31.43,14.07 31.43,14.22
  Bottom 0.457: 38.41,23.62 v41.05,26.26 | v31.5,23.62 38.41,23.62 | v31.5,14.07 31.43,14.07 | DOOR4.DAT1 83.31,56.13 83.31,59.18 85.34,59.18 91.03,53.49 91.03,38.46 74.57,38.46 71.12,35 71.12,23.42 38.41,23.42 38.41,23.62
N$1
  Top 0.61: R25.1 12.47,65.02 LED0.C
N$2
  Top 0.457: LED6.A 44.09,6.55 41.66,6.55 R6.1
N$3
  Top 0.61: Q1.2 36.83,63.75 31.43,63.75 R1.2
  Top 1.27: Q1.2 36.83,56.13 DOOR1.PWM
N$5
  Top 0.61: R1.1 28.98,65.02 LED1.C
N$6
  Top 0.61: R2.1 45.49,65.02 LED2.C
N$7
  Top 0.61: Q2.2 53.34,63.75 47.94,63.75 R2.2
  Top 1.27: Q2.2 53.34,56.13 DOOR2.PWM
N$8
  Top 0.61: R4.1 62,65.02 LED3.C
N$9
  Top 0.61: R5.1 78.51,64.71 LED4.C
N$11
  Bottom 0.457: R11.2 77.42,15.7 77.42,12.24 U$3.RX1
N$12
  Top 0.457: LED5.A 20.73,18.14 22.96,18.14 23.57,18.75 23.98,18.75 RL4.2
N$16
  Top 0.457: U$4.6 43.08,31.55 43.08,35 42.27,35.81 C3.2
N$22
  Top 0.61: Q3.2 69.85,63.75 64.45,63.75 R4.2
  Top 1.27: Q3.2 69.85,56.13 DOOR3.PWM
N$23
  Top 0.61: Q7.2 20.32,63.75 15.24,63.75 15.24,65.02 R25.2
  Top 1.27: Q7.2 20.32,56.13 DOOR0.PWM
N$24
  Bottom 0.457: R8.2 74.98,15.7 74.98,12.24 U$3.TX1
N$25
  Bottom 0.457: LED9.A 80.06,26.67 80.06,24.23 R12.1
N$26
  Bottom 0.457: LED11.A 77.42,26.67 77.42,24.23 R14.1
N$27
  Bottom 0.457: LED12.A 74.98,26.67 74.98,24.23 R39.1
N$31
  Top 0.61: Q4.2 86.36,63.75 80.96,63.75 R5.2
  Top 1.27: Q4.2 86.36,56.13 DOOR4.PWM
N$35
  Bottom 0.457: CFG.4 62.38,26.67 62.38,34.39 U$3.CFG
N$39
  Bottom 1.778: U$6.+12V 12.62,11.6 8.89,7.87 8.89,4.06 F1.1
N$42  (via drill 0.3)
  Top 0.457: U$4.17 33.12,25.65 33.12,26.87 | 33.12,26.87 33.12,27.89 R13.2 | v26.01,28.3 26.01,27.48 25.6,27.08 C8.2 | v27.64,28.7 29.06,27.28 29.06,27.08 X3.P$2 29.26,26.87 33.12,26.87
  Bottom 0.457: v26.01,28.3 26.42,28.7 v27.64,28.7
N$75
  Top 0.457: LED10.A 20.73,13.06 23.98,13.06 23.98,13.87 RL3.1
RD+  (via drill 0.3)
  Top 0.457: v43.08,27.69 43.08,27.89 44.7,29.52 44.7,31.34 U$4.4 | v20.52,29.52 19.3,30.73 R24.1
  Bottom 0.457: v43.08,27.69 42.47,27.08 22.96,27.08 v20.52,29.52
RD-  (via drill 0.3)
  Top 0.457: v46.33,36.02 46.33,35 45.72,34.39 45.72,31.55 U$4.3 | v21.95,36.63 19.3,33.98 R31.1
  Bottom 0.457: v46.33,36.02 45.72,36.63 v21.95,36.63
RESET  (via drill 0.3)
  Top 0.457: v28.04,7.16 29.06,6.15 36.78,6.15 v36.78,9.4 | v39.83,12.24 39.83,10.82 RESET1.2 | v36.17,35.81 36.17,28.91 37.19,28.91 U$4.13 | v53.44,34.39 53.44,29.52 52.43,28.5 v52.43,14.68
  Bottom 0.305: CON1.RESET 29.21,9.14 27.94,7.87
  Bottom 0.457: v28.04,7.16 28.04,7.77 27.94,7.87 | v36.78,9.4 38.81,11.43 39.83,11.43 | 39.83,11.43 41.86,11.43 C9.1 42.06,11.63 42.27,11.84 46.94,11.84 R15.1 47.14,12.04 49.78,12.04 v52.43,14.68 | 39.83,11.43 v39.83,12.24 | v36.17,35.81 45.52,35.81 46.94,34.39 v53.44,34.39
RX  (via drill 0.3)
  Top 0.457: v33.93,21.79 34.75,22.61 34.75,22.81 35.15,23.22 37.19,23.22 U$4.20
  Bottom 0.457: v33.93,21.79 51.21,21.79 55.47,17.53 74.78,17.53 R8.1
SCK  (via drill 0.3)
  Top 0.457: 40.84,35 40.84,37.44 44.09,40.69 v44.09,42.52 | 40.84,35 40.84,31.55 U$4.9 | v27.64,10.41 v29.87,10.41 | v26.01,11.02 26.01,16.31 26.62,16.92 26.62,18.54 21.34,23.83 v21.34,32.16 | v40.64,35 40.84,35
  Bottom 0.305: CON1.SCK 31.43,8.83 31.43,6.6
  Bottom 0.457: v44.09,42.52 45.31,43.74 55.68,43.74 64.41,52.48 80.87,52.48 81.89,53.49 DOOR4.DAT0 | v29.87,10.41 30.48,9.8 CON1.SCK | v27.64,10.41 27.03,11.02 v26.01,11.02 | v21.34,32.16 24.18,35 v40.64,35
TX  (via drill 0.3)
  Top 0.457: v33.93,20.78 35.36,22.2 35.36,22.4 37.19,22.4 U$4.21 | v54.05,17.93 55.68,17.93 v55.68,18.34
  Bottom 0.457: v33.93,20.78 36.78,17.93 v54.05,17.93 | v55.68,18.34 58.93,21.59 73.56,21.59 77.42,17.73 R11.1
VUSB  (via drill 0.3)
  Top 0.457: v42.27,27.89 42.27,31.34 U$4.7 | v19.91,22 12.19,29.72 12.19,32.77 | 12.19,32.77 11.38,33.58 9.55,33.58 X4.1 | v13.01,33.38 12.39,32.77 12.19,32.77
  Bottom 0.457: v42.27,27.89 38.81,31.34 19.91,31.34 17.88,33.38 C7.2 17.68,33.38 v13.01,33.38 | v19.91,22 23.77,18.14 D4.A
XTAL1  (via drill 0.3)
  Top 0.457: v26.01,30.53 26.01,31.55 25.6,31.95 C2.2 | v27.64,30.33 29.06,31.75 29.06,31.95 X3.P$1 29.26,31.75 32.92,31.75 32.92,30.94 R13.1 33.12,30.73 34.34,29.52 34.34,26.47 37.19,26.47 U$4.16
  Bottom 0.457: v26.01,30.53 26.21,30.33 v27.64,30.33

### Text on the board
tNames: Wiegand V1.0 | 1 | 1
bNames: USB | TX/RX | LINKLED
tValues: Wiegand v1.1
203bmp: C:/Users/G/Pictures/logo_epfl.bmp